# Altium schematic sheet [01] - CPU.SchDoc: Desk Digital Clock
size A4
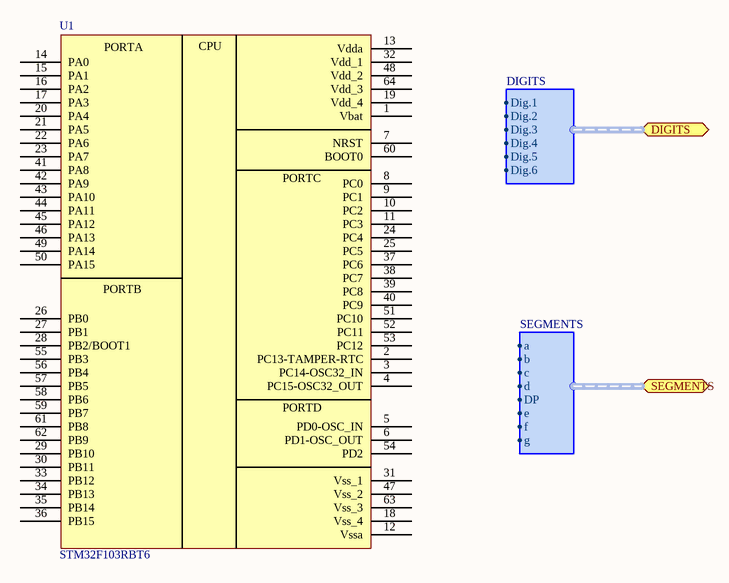
[diagram p0: [01] - CPU.SchDoc]

## Parts
U1  STM32F103RBT6

## Ports
DIGITS (harness DIGITS), SEGMENTS (harness SEGMENTS)

## Harnesses
SEGMENTS: a, b, c, d, DP, e, f, g
DIGITS: Dig.1, Dig.2, Dig.3, Dig.4, Dig.5, Dig.6

## Nets

Not connected (* = marked no-connect by the designer): U1 1(Vbat) 2(PC13-TAMPER-RTC) 3(PC14-OSC32_IN) 4(PC15-OSC32_OUT) 5(PD0-OSC_IN) 6(PD1-OSC_OUT) 7(NRST) 8(PC0) 9(PC1) 10(PC2) 11(PC3) 12(Vssa) 13(Vdda) 14(PA0) 15(PA1) 16(PA2) 17(PA3) 18(Vss_4) 19(Vdd_4) 20(PA4) 21(PA5) 22(PA6) 23(PA7) 24(PC4) 25(PC5) 26(PB0) 27(PB1) 28(PB2/BOOT1) 29(PB10) 30(PB11) 31(Vss_1) 32(Vdd_1) 33(PB12) 34(PB13) 35(PB14) 36(PB15) 37(PC6) 38(PC7) 39(PC8) 40(PC9) 41(PA8) 42(PA9) 43(PA10) 44(PA11) 45(PA12) 46(PA13) 47(Vss_2) 48(Vdd_2) 49(PA14) 50(PA15) 51(PC10) 52(PC11) 53(PC12) 54(PD2) 55(PB3) 56(PB4) 57(PB5) 58(PB6) 59(PB7) 60(BOOT0) 61(PB8) 62(PB9) 63(Vss_3) 64(Vdd_3)

## Notes on the sheet
- Title
- Size:
- Date:
- A4
- Number:
- Time:
- Revision:
- Sheet
- of
- File:
- (in symbol STM32F103RBT6) PORTA; CPU; PORTC; PORTB; PORTD

## Library data of the parts
U1 = STM32F103RBT6: IC MCU 32BIT 128KB FLASH 64LQFP; Manufacturer: STMicroelectronics; Datasheet: https://www.st.com/resource/en/datasheet/cd00161566.pdf; P/N: STM32F103RBT6